# Altium schematic sheet Sheet2.SCHDOC
size 431 x 279 mm; SheetNumber: 0; SheetTotal: 0
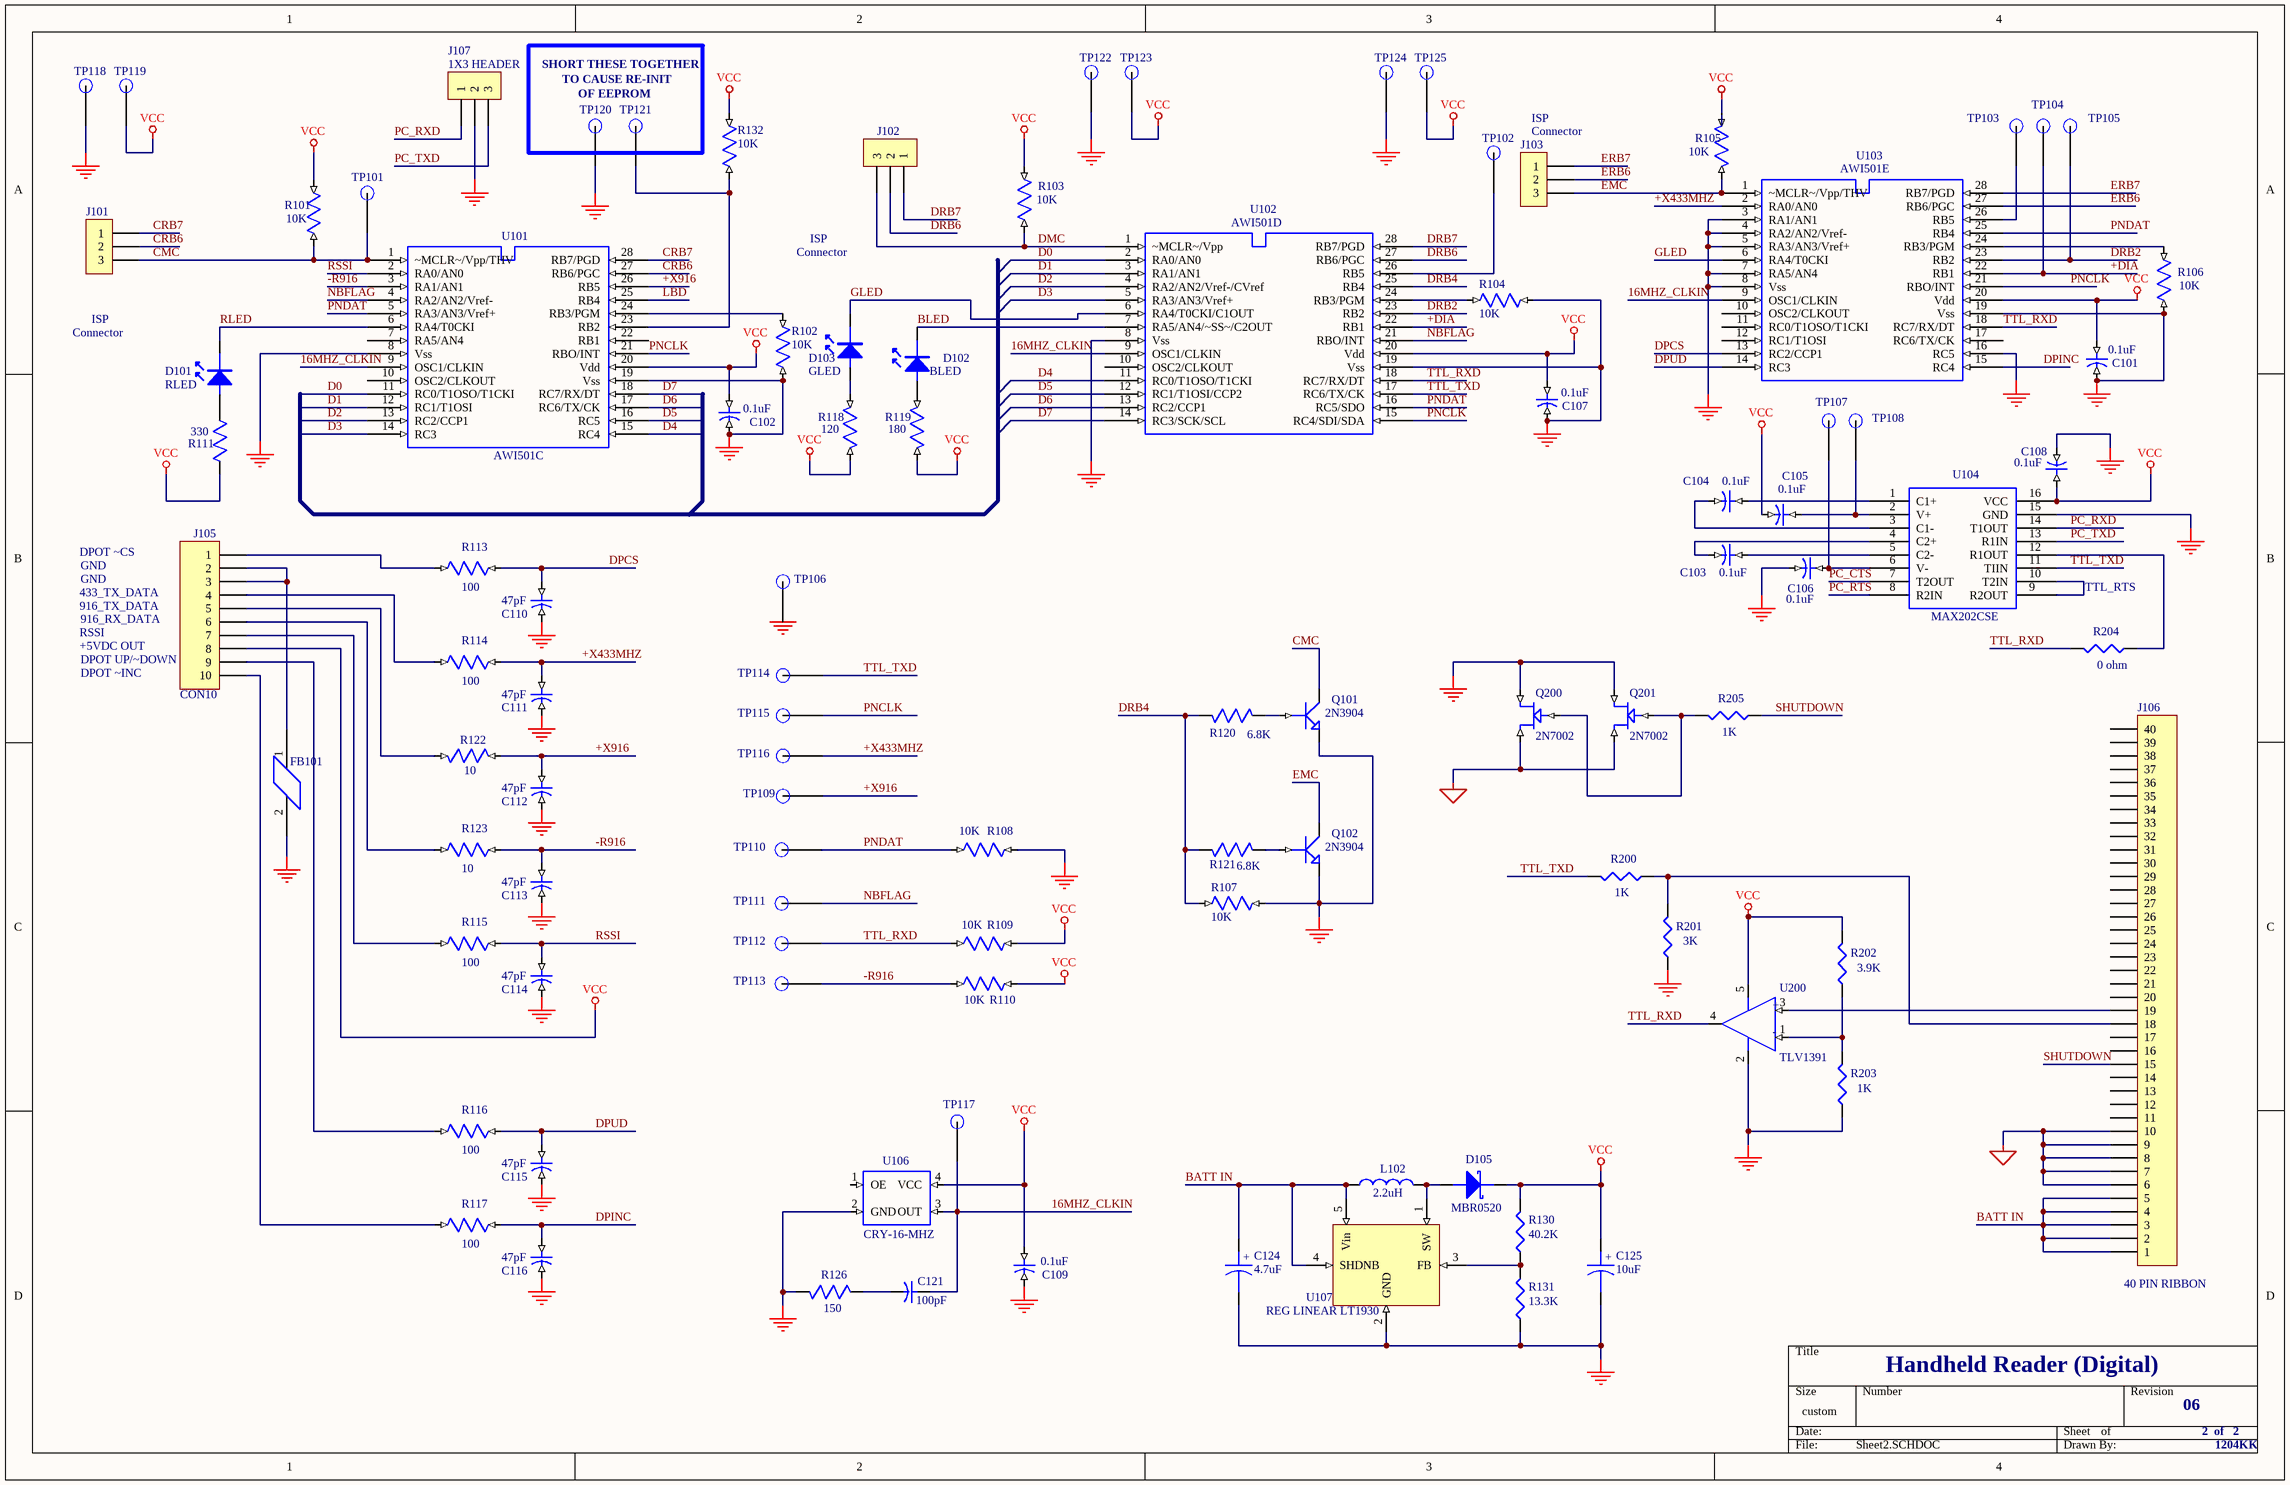
[diagram p0: Sheet2.SCHDOC]

## Parts
C101  0.1uF  [0603]
C102  0.1uF  [0603]
C103  0.1uF  [0603]
C104  0.1uF  [0603]
C105  0.1uF  [0603]
C106  0.1uF  [0603]
C107  0.1uF  [0603]
C108  0.1uF  [0603]
C109  0.1uF  [0603]
C110  47pF  [0603]
C111  47pF  [0603]
C112  47pF  [0603]
C113  47pF  [0603]
C114  47pF  [0603]
C115  47pF  [0603]
C116  47pF  [0603]
C121  100pF  [0603]
C124  4.7uF  [CAP A CASE]
C125  10uF  [CAP A CASE]
D101  RLED  [SOD123 DIODE]
D102  BLED  [SOD123 DIODE]
D103  GLED  [SOD123 DIODE]
D105  MBR0520  [SOD123]
FB101  FB 0603  [0603]  (value not drawn)
J101  1X3 HEADER  [1X3 HEADER]  (value not drawn)
J102  1X3 HEADER  [1X3 HEADER]  (value not drawn)
J103  1X3 HEADER  [1X3 HEADER]  (value not drawn)
J105  CON10  [1X10 HEADER SPECIAL]
J106  40 PIN RIBBON  [40 PIN RIBBON CONN]
J107  1X3 HEADER  [1X3 HEADER]
L102  2.2uH  [COIL BOURNS SDR7030-330M]
Q101  2N3904  [SOT23 TRANS]
Q102  2N3904  [SOT23 TRANS]
Q200  2N7002  [SOT23 FET]
Q201  2N7002  [SOT23 FET]
R101  10K  [0603]
R102  10K  [0603]
R103  10K  [0603]
R104  10K  [0603]
R105  10K  [0603]
R106  10K  [0603]
R107  10K  [0603]
R108  10K  [0603]
R109  10K  [0603]
R110  10K  [0603]
R111  330  [0603]
R113  100  [0603]
R114  100  [0603]
R115  100  [0603]
R116  100  [0603]
R117  100  [0603]
R118  120  [0603]
R119  180  [0603]
R120  6.8K  [0603]
R121  6.8K  [0603]
R122  10  [0603]
R123  10  [0603]
R126  150  [0603]
R130  40.2K  [0603]
R131  13.3K  [0603]
R132  10K  [0603]
R200  1K  [0603]
R201  3K  [0603]
R202  3.9K  [0603]
R203  1K  [0603]
R204  0 ohm  [0603]
R205  1K  [0603]
TP101  TP  [TEST POINT PAD]  (value not drawn)
TP102  TP  [TEST POINT PAD]  (value not drawn)
TP103  TP  [TEST POINT PAD]  (value not drawn)
TP104  TP  [TEST POINT PAD]  (value not drawn)
TP105  TP  [TEST POINT PAD]  (value not drawn)
TP106  TP  [TEST POINT PAD]  (value not drawn)
TP107  TP  [TEST POINT PAD]  (value not drawn)
TP108  TP  [TEST POINT PAD]  (value not drawn)
TP109  TP  [TEST POINT PAD]  (value not drawn)
TP110  TP  [TEST POINT PAD]  (value not drawn)
TP111  TP  [TEST POINT PAD]  (value not drawn)
TP112  TP  [TEST POINT PAD]  (value not drawn)
TP113  TP  [TEST POINT PAD]  (value not drawn)
TP114  TP  [TEST POINT PAD]  (value not drawn)
TP115  TP  [TEST POINT PAD]  (value not drawn)
TP116  TP  [TEST POINT PAD]  (value not drawn)
TP117  TP  [TEST POINT PAD]  (value not drawn)
TP118  TP  [TEST POINT PAD]  (value not drawn)
TP119  TP  [TEST POINT PAD]  (value not drawn)
TP120  TP  [TEST POINT PAD]  (value not drawn)
TP121  TP  [TEST POINT PAD]  (value not drawn)
TP122  TP  [TEST POINT PAD]  (value not drawn)
TP123  TP  [TEST POINT PAD]  (value not drawn)
TP124  TP  [TEST POINT PAD]  (value not drawn)
TP125  TP  [TEST POINT PAD]  (value not drawn)
U101  AWI501C  [SSOP28]
U102  AWI501D  [SSOP28]
U103  AWI501E  [SSOP28]
U104  MAX202CSE  [SO16]
U106  CRY-16-MHZ  [SMT OSCILLATOR]
U107  REG LINEAR LT1930  [SOT23-5A]
U200  TLV1391  [SOT25]

## Nets
GND1: J106.6 J106.7 J106.8 J106.9 J106.10 Q200.S Q201.S
GND_COM: C101.2(B) C102.2(B) C106.2(B) C107.2(B) C108.2(B) C109.2(B) C110.2(B) C111.2(B) C112.2(B) C113.2(B) C114.2(B) C115.2(B) C116.2(B) C124.2 C125.2 FB101.2 J107.2 Q101.E Q102.E Q200.D Q201.D R102.2(B) R104.1(A) R106.2(B) R107.2(B) R108.1(A) R126.2(B) R131.1 R201.1 R203.1 TP106.1(TP) TP118.1(TP) TP120.1(TP) TP122.1(TP) TP124.1(TP) U101.8(Vss) U101.19(Vss) U102.8(Vss) U102.19(Vss) U103.3(RA1/AN1) U103.4(RA2/AN2/Vref-) U103.5(RA3/AN3/Vref+) U103.7(RA5/AN4) U103.8(Vss) U103.16(RC5) U103.19(Vss) U104.15(GND) U106.2(GND) U107.2(GND) U200.2(VSS)
VCC: C101.1(A) C102.1(A) C105.2(B) C107.1(A) C108.1(A) C109.1(A) C125.1 D105.K J105.8 R101.1(A) R103.1(A) R105.1(A) R109.1(A) R110.1(A) R111.1(A) R118.1(A) R119.1(A) R130.2 R132.1(A) R202.2 TP119.1(TP) TP123.1(TP) TP125.1(TP) U101.20(Vdd) U102.20(Vdd) U103.20(Vdd) U104.16(VCC) U106.4(VCC) U200.5(VDD)
16MHZ_CLKIN: C121.1(A) TP117.1(TP) U101.9(OSC1/CLKIN) U102.9(OSC1/CLKIN) U103.9(OSC1/CLKIN) U106.3(OUT)
+DIA: TP104.1(TP) U102.22(RB1) U103.22(RB1)
+X433MHZ: C111.1(A) R114.2(B) TP116.1(TP) U103.2(RA0/AN0)
+X916: C112.1(A) R122.1(A) TP109.1(TP) U101.26(RB5)
-R916: C113.1(A) R110.2(B) R123.2(B) TP113.1(TP) U101.3(RA1/AN1)
BATT IN: C124.1 J106.1 J106.2 J106.3 J106.4 J106.5 L102.1 U107.4(SHDNB) U107.5(Vin)
BLED: D102.K U102.7(RA5/AN4/~SS~/C2OUT)
CMC: J101.3 Q101.C R101.2(B) TP101.1(TP) U101.1(~MCLR~/Vpp/THV)
CRB6: J101.2 U101.27(RB6/PGC)
CRB7: J101.1 U101.28(RB7/PGD)
D0: U101.11(RC0/T1OSO/T1CKI) U102.2(RA0/AN0)
D1: U101.12(RC1/T1OSI) U102.3(RA1/AN1)
D2: U101.13(RC2/CCP1) U102.4(RA2/AN2/Vref-/CVref)
D3: U101.14(RC3) U102.5(RA3/AN3/Vref+)
D4: U101.15(RC4) U102.11(RC0/T1OSO/T1CKI)
D5: U101.16(RC5) U102.12(RC1/T1OSI/CCP2)
D6: U101.17(RC6/TX/CK) U102.13(RC2/CCP1)
D7: U101.18(RC7/RX/DT) U102.14(RC3/SCK/SCL)
DMC: J102.3 R103.2(B) U102.1(~MCLR~/Vpp)
DPCS: C110.1(A) R113.2(B) U103.13(RC2/CCP1)
DPINC: C116.1(A) R117.2(B) U103.15(RC4)
DPUD: C115.1(A) R116.2(B) U103.14(RC3)
DRB2: TP105.1(TP) U102.23(RB2) U103.23(RB2)
DRB4: R107.1(A) R120.1(A) R121.1(A) U102.25(RB4)
DRB6: J102.2 U102.27(RB6/PGC)
DRB7: J102.1 U102.28(RB7/PGD)
EMC: J103.3 Q102.C R105.2(B) U103.1(~MCLR~/Vpp/THV)
ERB6: J103.2 U103.27(RB6/PGC)
ERB7: J103.1 U103.28(RB7/PGD)
GLED: D103.K U102.6(RA4/T0CKI/C1OUT) U103.6(RA4/T0CKI)
LBD: U101.25(RB4)
NBFLAG: TP111.1(TP) U101.4(RA2/AN2/Vref-) U102.21(RBO/INT)
PC_CTS: U104.7(T2OUT)
PC_RTS: U104.8(R2IN)
PC_RXD: J107.1 U104.14(T1OUT)
PC_TXD: J107.3 U104.13(R1IN)
PNCLK: TP115.1(TP) U101.21(RBO/INT) U102.15(RC4/SDI/SDA) U103.21(RBO/INT)
PNDAT: R108.2(B) TP110.1(TP) U101.5(RA3/AN3/Vref+) U102.16(RC5/SDO) U103.25(RB4)
RLED: D101.K U101.6(RA4/T0CKI)
RSSI: C114.1(A) R115.2(B) U101.2(RA0/AN0)
SHUTDOWN: J106.15 R205.1
TTL_RXD: R109.2(B) R204.2 TP112.1(TP) U102.18(RC7/RX/DT) U103.18(RC7/RX/DT) U200.4(OUT)
TTL_TXD: R200.2 TP114.1(TP) U102.17(RC6/TX/CK) U104.11(TIIN)
NetC103_1: C103.1(A) U104.5(C2-)
NetC103_2: C103.2(B) U104.4(C2+)
NetC104_1: C104.1(A) U104.1(C1+)
NetC104_2: C104.2(B) U104.3(C1-)
NetC105_1: C105.1(A) TP108.1(TP) U104.2(V+)
NetC106_1: C106.1(A) TP107.1(TP) U104.6(V-)
NetC121_2: C121.2(B) R126.1(A)
NetD101_A: D101.A R111.2(B)
NetD102_A: D102.A R119.2(B)
NetD103_A: D103.A R118.2(B)
NetD105_A: D105.A L102.2 U107.1(SW)
NetFB101_1: FB101.1 J105.2 J105.3
NetJ105_1: J105.1 R113.1(A)
NetJ105_4: J105.4 R114.1(A)
NetJ105_5: J105.5 R122.2(B)
NetJ105_6: J105.6 R123.1(A)
NetJ105_7: J105.7 R115.1(A)
NetJ105_9: J105.9 R116.1(A)
NetJ105_10: J105.10 R117.1(A)
NetJ106_18: J106.18 R200.1 R201.2
NetJ106_19: J106.19 U200.3(+)
NetQ101_B: Q101.B R120.2(B)
NetQ102_B: Q102.B R121.2(B)
NetQ200_G: Q200.G Q201.G R205.2
NetR102_1: R102.1(A) U101.24(RB3/PGM)
NetR104_2: R104.2(B) U102.24(RB3/PGM)
NetR106_1: R106.1(A) U103.24(RB3/PGM)
NetR130_1: R130.1 R131.2 U107.3(FB)
NetR132_2: R132.2(B) TP121.1(TP) U101.23(RB2)
NetR202_1: R202.1 R203.2 U200.1(-)
NetR204_1: R204.1 U104.12(R1OUT)
NetTP102_1: TP102.1(TP) U102.26(RB5)
NetTP103_1: TP103.1(TP) U103.26(RB5)
NetU104_9: U104.9(R2OUT) U104.10(T2IN)

Not connected (* = marked no-connect by the designer): J106 11 12 13 14 16 17 20 21 22 23 24 25 26 27 28 29 30 31 32 33 34 35 36 37 38 39 40; U101 7(RA5/AN4) 10(OSC2/CLKOUT) 22(RB1); U102 10(OSC2/CLKOUT); U103 10(OSC2/CLKOUT) 11(RC0/T1OSO/T1CKI) 12(RC1/T1OSI) 17(RC6/TX/CK); U106 1(OE)

## Notes on the sheet
- SHORT THESE TOGETHER
- TO CAUSE RE-INIT
- OF EEPROM
- ISP
- Connector
- DPOT ~CS
- GND
- 916_TX_DATA
- 433_TX_DATA
- RSSI
- 916_RX_DATA
- TTL_RTS
- +5VDC OUT
- DPOT ~INC
- DPOT UP/~DOWN
- Handheld Reader (Digital)
- 06
- 2  of   2
- 1204KK
- (in symbol CAPACITOR POL) +

## Library data of the parts
C101-C109 = C_603: Part Field 1: Part Number ECJ-1VF1H104Z; Part Field 2: Vendor Panasonic - ECG; Part Field 3: Description CAP .1UF 50V CERAMIC Y5V 0603
C110-C116 = C0603: Part Field 1: Part Number 0603N470J500NT; Part Field 2: Vendor BC Components; Part Field 3: Description Cap, Ceramic, 47pF, 50V, NP0, 0603, SMD
C121 = C_0603: Part Field 1: Part Number ECJ-1VC1H101J; Part Field 2: Vendor Panasonic - ECG; Part Field 3: Description CAP CERAMIC 100PF 50V 0603 SMD
C124 C125 = CAPACITOR POL: Capacitor
D101-D103 = LED
D105 = DIODE SCHOTTKY: Schottky Diode
FB101 = FB_0603: Part Field 1: Part Number EXC-ML16A270U; Part Field 2: Vendor Panasonic - ECG; Part Field 3: Description BEAD CORE 27 OHM 4A 0603 SMD
J101-J103 J107 = CON3: Connector
J105 = CON10: Connector
J106 = CON40: Connector
L102 = INDUCTOR1
Q101 Q102 = NPN1: NPN Transistor
Q200 Q201 = JFET N
R101-R110 R132 = R_603: Part Field 1: Part Number ERA-V15J103V; Part Field 2: Vendor Panasonic - ECG; Part Field 3: Description RES 10K OHM 1/16W 1500PPM 5%0603
R111 = R_0603: Part Field 1: Part Number ERJ-3GEYJ331V; Part Field 2: Vendor Panasonic - ECG; Part Field 3: Description RES 330 OHM 1/10W 5% 0603 SMD
R113-R117 R123 = R0603: Part Field 1: Part Number 9C06031A1000JLHFT; Part Field 2: Vendor Yageo America; Part Field 3: Description RES, 100 OHM, 1/10W, 5%, 0603, SMD
R118 = R0402: Part Field 1: Part Number ERJ-3GEYJ121V; Part Field 2: Vendor Panasonic - ECG; Part Field 3: Description RES 120 OHM 1/10W 5% 0603 SMD
R119 = R0402: Part Field 1: Part Number ERJ-3GEYJ181V; Part Field 2: Vendor Panasonic - ECG; Part Field 3: Description RES 180 OHM 1/10W 5% 0603 SMD
R120 R121 = R_0603: Part Field 1: Part Number ERJ-3GEYJ682V; Part Field 2: Vendor Panasonic - ECG; Part Field 3: Description RES 6.8K OHM 1/10W 5% 0603 SMD
R122 = R_603: Part Field 1: Part Number 9C06031A10R0FKHFT; Part Field 2: Vendor Yageo America; Part Field 3: Description RES, 10, OHM, 1/16W, 5%, 0603, SMD
R126 = R_0603: Part Field 1: Part Number 9C06031A1500JLHFT; Part Field 2: Vendor Yageo America; Part Field 3: Description RES 150 OHM 1/16W 5% 0603 SMD
R130 R131 R200-R205 = RES1
TP101-TP125 = TESTPOINT_1
U101 U103 = PIC16F870: Part Field 1: Part Number PIC16F870-E/SO; Part Field 2: Vendor Microchip Technology; Part Field 3: Description IC MCU CMOS 20MHZ 2K FLSH 28SOIC
U102 = PIC16F876A: Part Field 1: Part Number PIC16F876A-E/SO; Part Field 2: Vendor Microchip Technology; Part Field 3: Description IC MCU FLASH 8KX14 W/AD 28-SOIC
U104 = MAX202CSE: Part Field 1: Part Number MAX202CSE; Part Field 2: Vendor Maxim; Part Field 3: Description IC TRANSCEIVER RS232 5V 16-SOIC
U106 = CRY-SMD-5-7
U200 = TLV1391: Text Field1: 40; Text Field2: 40